# EAGLE design generic_control_board (EAGLE 5.01)
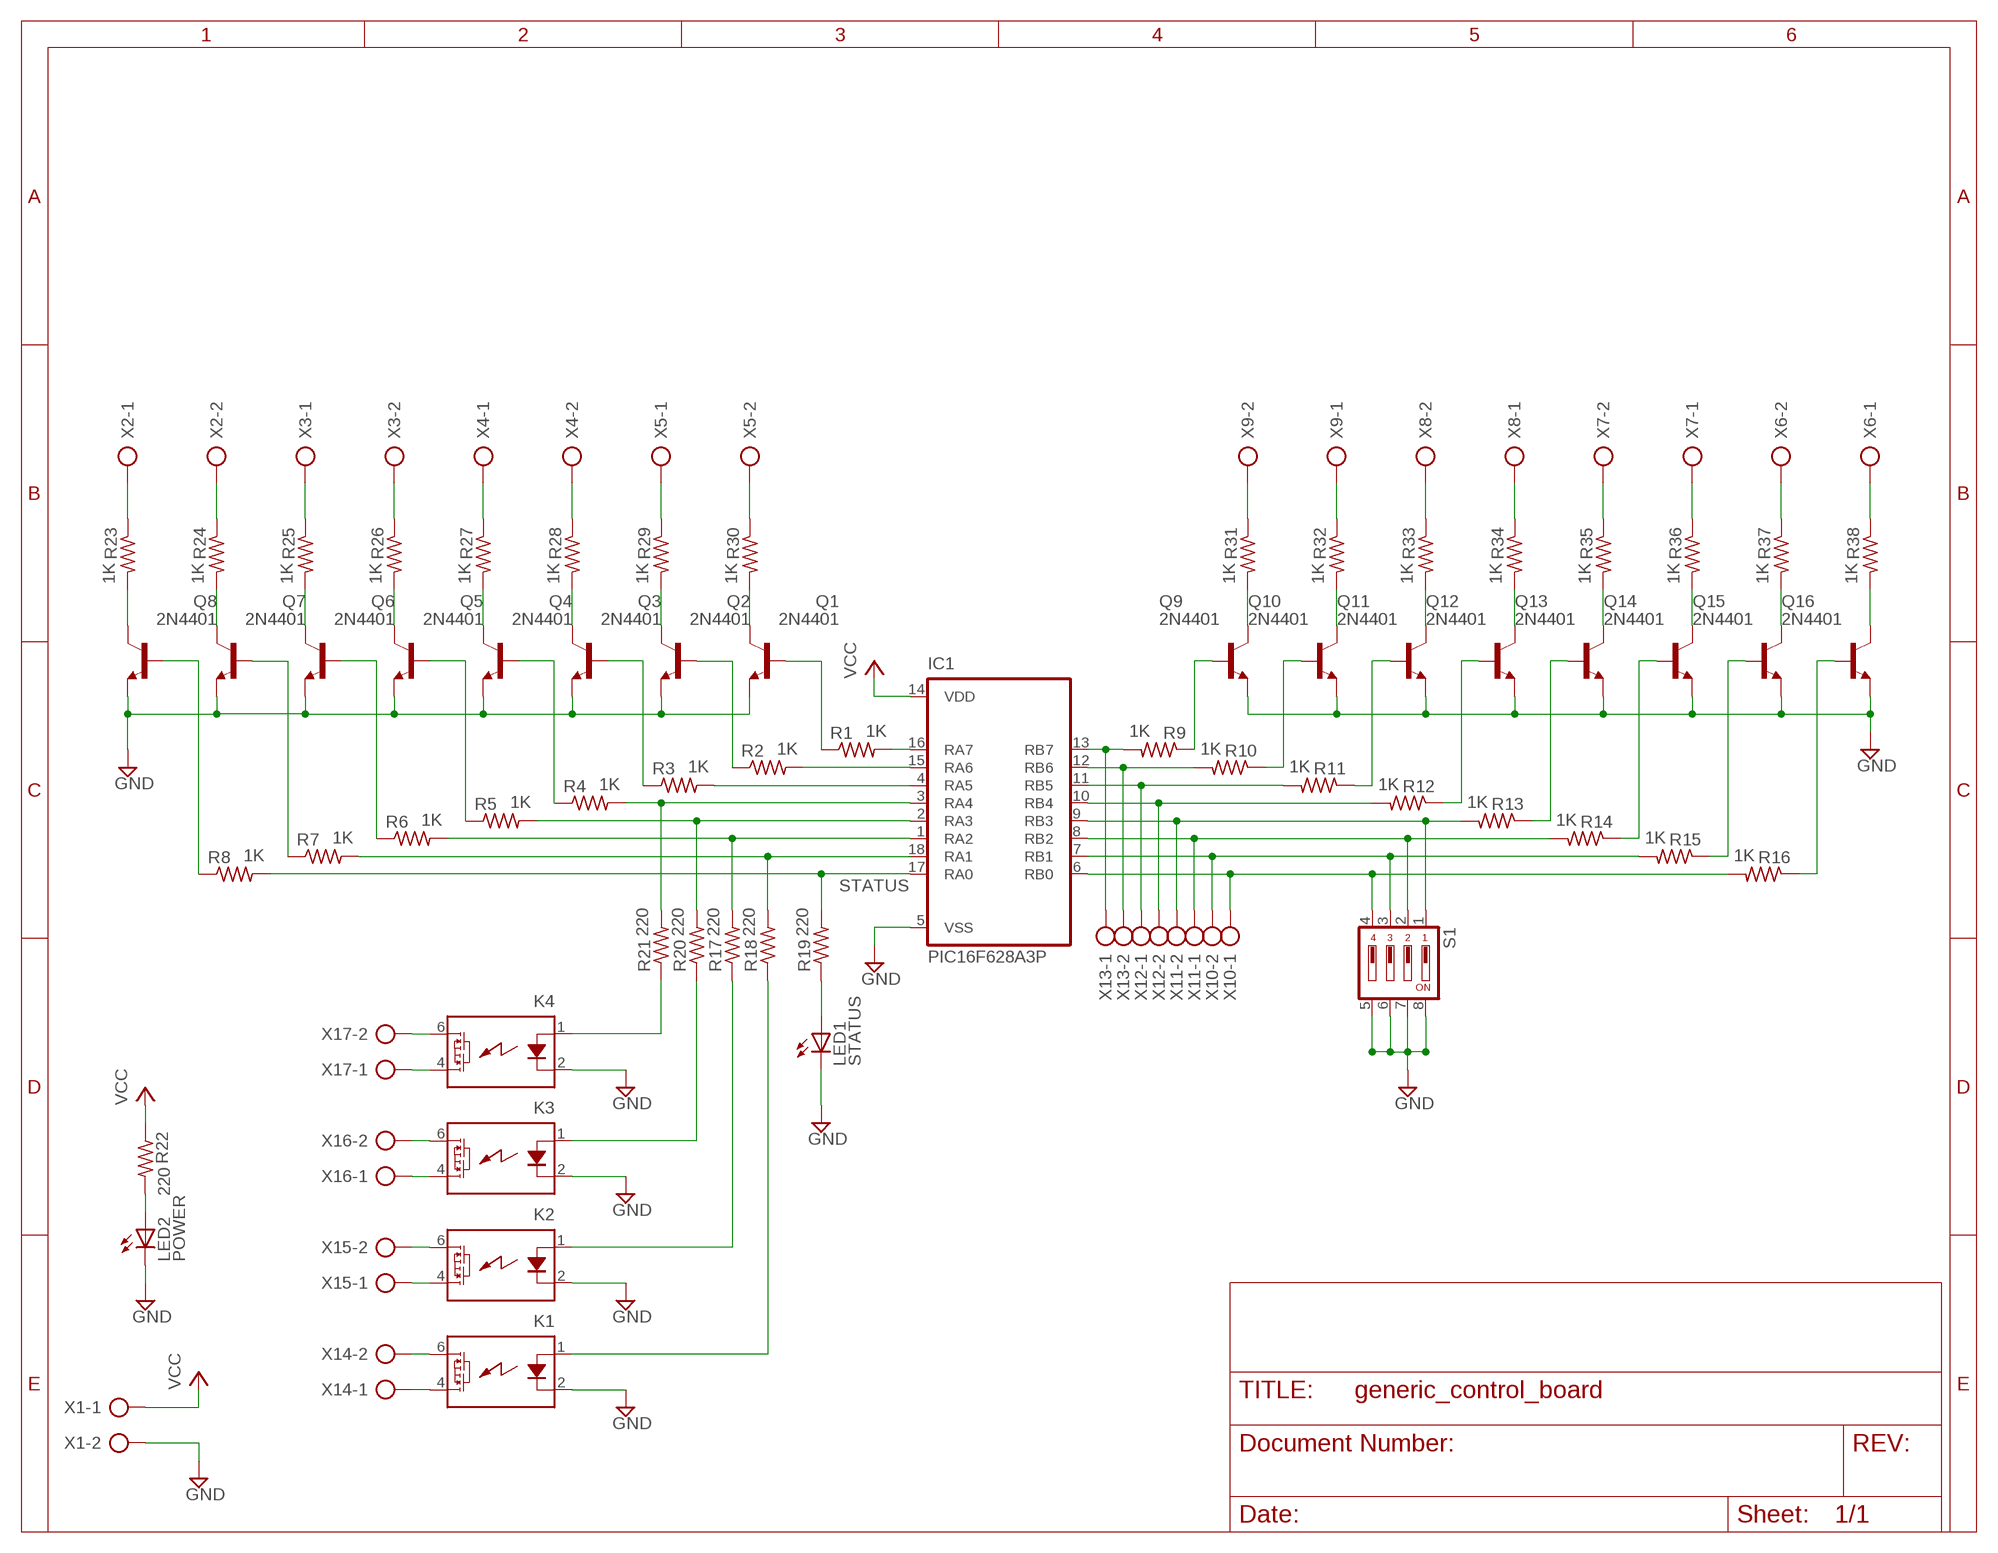
[diagram p0: schematic, sheet 1]

## Parts
IC1  PIC16F628A3P  [DIL18]
K1  LCA110  [DIL06]
K2  LCA110  [DIL06]
K3  LCA110  [DIL06]
K4  LCA110  [DIL06]
LED1  STATUS  LED3MM  [LED3MM]
LED2  POWER  LED3MM  [LED3MM]
Q1  2N4401  [TO92-CBE]
Q2  2N4401  [TO92-CBE]
Q3  2N4401  [TO92-CBE]
Q4  2N4401  [TO92-CBE]
Q5  2N4401  [TO92-CBE]
Q6  2N4401  [TO92-CBE]
Q7  2N4401  [TO92-CBE]
Q8  2N4401  [TO92-CBE]
Q9  2N4401  [TO92-CBE]
Q10  2N4401  [TO92-CBE]
Q11  2N4401  [TO92-CBE]
Q12  2N4401  [TO92-CBE]
Q13  2N4401  [TO92-CBE]
Q14  2N4401  [TO92-CBE]
Q15  2N4401  [TO92-CBE]
Q16  2N4401  [TO92-CBE]
R1  1K  R-US_0207/2V  [0207/2V]
R2  1K  R-US_0207/2V  [0207/2V]
R3  1K  R-US_0207/2V  [0207/2V]
R4  1K  R-US_0207/2V  [0207/2V]
R5  1K  R-US_0207/2V  [0207/2V]
R6  1K  R-US_0207/2V  [0207/2V]
R7  1K  R-US_0207/2V  [0207/2V]
R8  1K  R-US_0207/2V  [0207/2V]
R9  1K  R-US_0207/2V  [0207/2V]
R10  1K  R-US_0207/2V  [0207/2V]
R11  1K  R-US_0207/2V  [0207/2V]
R12  1K  R-US_0207/2V  [0207/2V]
R13  1K  R-US_0207/2V  [0207/2V]
R14  1K  R-US_0207/2V  [0207/2V]
R15  1K  R-US_0207/2V  [0207/2V]
R16  1K  R-US_0207/2V  [0207/2V]
R17  220  R-US_0207/2V  [0207/2V]
R18  220  R-US_0207/2V  [0207/2V]
R19  220  R-US_0207/2V  [0207/2V]
R20  220  R-US_0207/2V  [0207/2V]
R21  220  R-US_0207/2V  [0207/2V]
R22  220  R-US_0207/2V  [0207/2V]
R23  1K  R-US_0207/2V  [0207/2V]
R24  1K  R-US_0207/2V  [0207/2V]
R25  1K  R-US_0207/2V  [0207/2V]
R26  1K  R-US_0207/2V  [0207/2V]
R27  1K  R-US_0207/2V  [0207/2V]
R28  1K  R-US_0207/2V  [0207/2V]
R29  1K  R-US_0207/2V  [0207/2V]
R30  1K  R-US_0207/2V  [0207/2V]
R31  1K  R-US_0207/2V  [0207/2V]
R32  1K  R-US_0207/2V  [0207/2V]
R33  1K  R-US_0207/2V  [0207/2V]
R34  1K  R-US_0207/2V  [0207/2V]
R35  1K  R-US_0207/2V  [0207/2V]
R36  1K  R-US_0207/2V  [0207/2V]
R37  1K  R-US_0207/2V  [0207/2V]
R38  1K  R-US_0207/2V  [0207/2V]
S1  DIP04YL  [DIP04YL]
X1  AK500/2  [AK500/2]
X2  AK500/2  [AK500/2]
X3  AK500/2  [AK500/2]
X4  AK500/2  [AK500/2]
X5  AK500/2  [AK500/2]
X6  AK500/2  [AK500/2]
X7  AK500/2  [AK500/2]
X8  AK500/2  [AK500/2]
X9  AK500/2  [AK500/2]
X10  AK500/2  [AK500/2]
X11  AK500/2  [AK500/2]
X12  AK500/2  [AK500/2]
X13  AK500/2  [AK500/2]
X14  AK500/2  [AK500/2]
X15  AK500/2  [AK500/2]
X16  AK500/2  [AK500/2]
X17  AK500/2  [AK500/2]

## Nets
AC1-A: K1.6(D1) X14.2
AC1-B: K1.4(D2) X14.1
AC2-A: K2.6(D1) X15.2
AC2-B: K2.4(D2) X15.1
AC3-A: K3.6(D1) X16.2
AC3-B: K3.4(D2) X16.1
AC4-A: K4.6(D1) X17.2
AC4-B: K4.4(D2) X17.1
GND: IC1.5(VSS) K1.2(K) K2.2(K) K3.2(K) K4.2(K) LED1.K(C) LED2.K(C) Q1.E Q2.E Q3.E Q4.E Q5.E Q6.E Q7.E Q8.E Q9.E Q10.E Q11.E Q12.E Q13.E Q14.E Q15.E Q16.E S1.5 S1.6 S1.7 S1.8 X1.2
IN1: IC1.6(RB0) R16.2 S1.4 X10.1
IN2: IC1.7(RB1) R15.2 S1.3 X10.2
IN3: IC1.8(RB2) R14.2 S1.2 X11.1
IN4: IC1.9(RB3) R13.2 S1.1 X11.2
IN5: IC1.10(RB4) R12.2 X12.2
IN6: IC1.11(RB5) R11.2 X12.1
IN7: IC1.12(RB6) R10.2 X13.2
IN8: IC1.13(RB7) R9.2 X13.1
N$1: Q16.C R38.2
N$2: Q15.C R37.2
N$3: Q11.B R11.1
N$4: Q8.B R8.1
N$5: Q1.B R1.1
N$6: Q14.C R36.2
N$7: Q2.B R2.1
N$8: Q3.B R3.1
N$9: Q4.B R4.1
N$10: Q5.B R5.1
N$11: Q12.B R12.1
N$12: Q13.B R13.1
N$13: Q14.B R14.1
N$14: Q6.B R6.1
N$15: Q13.C R35.2
N$16: Q12.C R34.2
N$17: Q11.C R33.2
N$18: Q10.C R32.2
N$20: Q1.C R30.2
N$22: Q7.B R7.1
N$23: Q15.B R15.1
N$25: Q2.C R29.2
N$31: Q16.B R16.1
N$32: LED1.A R19.1
N$34: Q3.C R28.2
N$35: Q4.C R27.2
N$36: Q5.C R26.2
N$37: Q6.C R25.2
N$38: Q7.C R24.2
N$39: Q8.C R23.2
N$40: R23.1 X2.1
N$41: R24.1 X2.2
N$42: R25.1 X3.1
N$43: R26.1 X3.2
N$44: R27.1 X4.1
N$45: R28.1 X4.2
N$46: R29.1 X5.1
N$47: R30.1 X5.2
N$48: K2.1(A) R17.1
N$49: K1.1(A) R18.1
N$50: R31.1 X9.2
N$51: Q10.B R10.1
N$52: R32.1 X9.1
N$53: R33.1 X8.2
N$54: R34.1 X8.1
N$55: K4.1(A) R21.1
N$56: K3.1(A) R20.1
N$57: R35.1 X7.2
N$58: R36.1 X7.1
N$59: R37.1 X6.2
N$60: R38.1 X6.1
N$61: LED2.A R22.2
OUT2: IC1.18(RA1) R7.2 R18.2
OUT3: IC1.1(RA2) R6.2 R17.2
OUT4: IC1.2(RA3) R5.2 R20.2
OUT5: IC1.3(RA4) R4.2 R21.2
OUT6: IC1.4(RA5) R3.2
OUT7: IC1.15(RA6) R2.2
OUT8: IC1.16(RA7) R1.2
Q9B: Q9.B R9.1
Q9C: Q9.C R31.2
STATUS: IC1.17(RA0) R8.2 R19.2
VCC: IC1.14(VDD) R22.1 X1.1

## Library data of the parts
IC1 = microchip:PIC16F628A: MICROCONTROLLER 8-Bit PIC16F628 Family - CMOS Flash/EEPROM Pin Compatible : PIC16F83, PIC16CR83, PIC16F84A, PIC16CR84 see also PIC16C*
K1-K4 = relay:LCA110: Solid state relay. Clare LCA110
LED1 LED2 = led:LED: LED OSRAM: - CHIPLED LG R971, LG N971, LY N971, LG Q971, LY Q971, LO R971, LY R971 LH N974, LH R974 LS Q976, LO Q976, LY Q976 LO Q996 - Hyper CHIPLED LW Q18S LB Q993, LB Q99A, LB R99A - SideLED LS A670, LO A670, LY A670, LG A670, LP A670 LB A673, LV A673, LT A673, LW A673 LH A674 LY A675 LS A676, LA A676, LO A676, LY A676, LW A676 LS A679, LY A679, LG A679 - Hyper Micro SIDELED® LS Y876, LA Y876, LO Y876, LY Y876 LT Y87S - SmartLED LW L88C, LW L88S LB L89C, LB L89S, LG L890 LS L89K, LO L89K, LY L89K LS L896, LA L896, LO L896, LY L896 - TOPLED LS T670, LO T670, LY T670, LG T670, LP T670 LSG T670, LSP T670, LSY T670, LOP T670, LYG T670 LG T671, LOG T671, LSG T671 LB T673, LV T673, LT T673, LW T673 LH T674 LS T676, LA T676, LO T676, LY T676, LB T676, LH T676, LSB T676, LW T676 LB T67C, LV T67C, LT T67C, LS T67K, LO T67K, LY T67K, LW E67C LS E67B, LA E67B, LO E67B, LY E67B, LB E67C, LV E67C, LT E67C LW T67C LS T679, LY T679, LG T679 LS T770, LO T770, LY T770, LG T770, LP T770 LB T773, LV T773, LT T773, LW T773 LH T774 LS E675, LA E675, LY E675, LS T675 LS T776, LA T776, LO T776, LY T776, LB T776 LHGB T686 LT T68C, LB T68C - Hyper Mini TOPLED® LB M676 - Mini TOPLED Santana® LG M470 LS M47K, LO M47K, LY M47K Source: http://www.osram.convergy.de - LUMILED® LXK2-PW12-R00, LXK2-PW12-S00, LXK2-PW14-U00, LXK2-PW14-V00 LXK2-PM12-R00, LXK2-PM12-S00, LXK2-PM14-U00 LXK2-PE12-Q00, LXK2-PE12-R00, LXK2-PE12-S00, LXK2-PE14-T00, LXK2-PE14-U00 LXK2-PB12-K00, LXK2-PB12-L00, LXK2-PB12-M00, LXK2-PB14-N00, LXK2-PB14-P00, LXK2-PB14-Q00 LXK2-PR12-L00, LXK2-PR12-M00, LXK2-PR14-Q00, LXK2-PR14-R00 LXK2-PD12-Q00, LXK2-PD12-R00, LXK2-PD12-S00 LXK2-PH12-R00, LXK2-PH12-S00 LXK2-PL12-P00, LXK2-PL12-Q00, LXK2-PL12-R00 Source: www.luxeon.com
Q1-Q16 = transistor-npn:2N4401: Small signal transistor
R1-R38 = rcl:R-US_: RESISTOR, American symbol
S1 = switch-dil:DIP04YL: DIL/CODE SWITCH
X1-X17 = con-ptr500:AK500/2: CONNECTOR

## Board
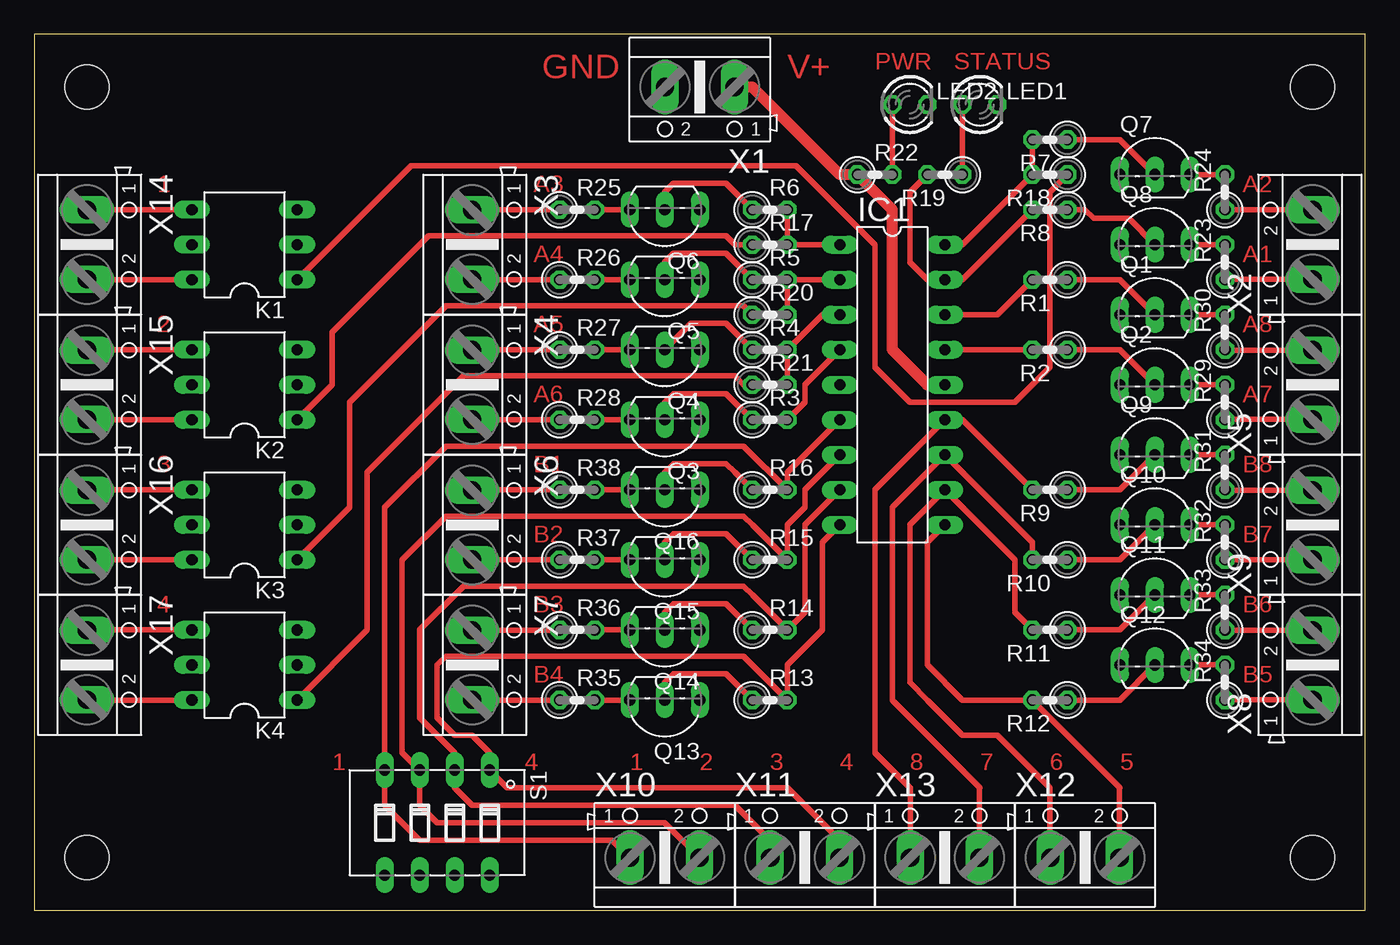
[diagram p1: board, top side]
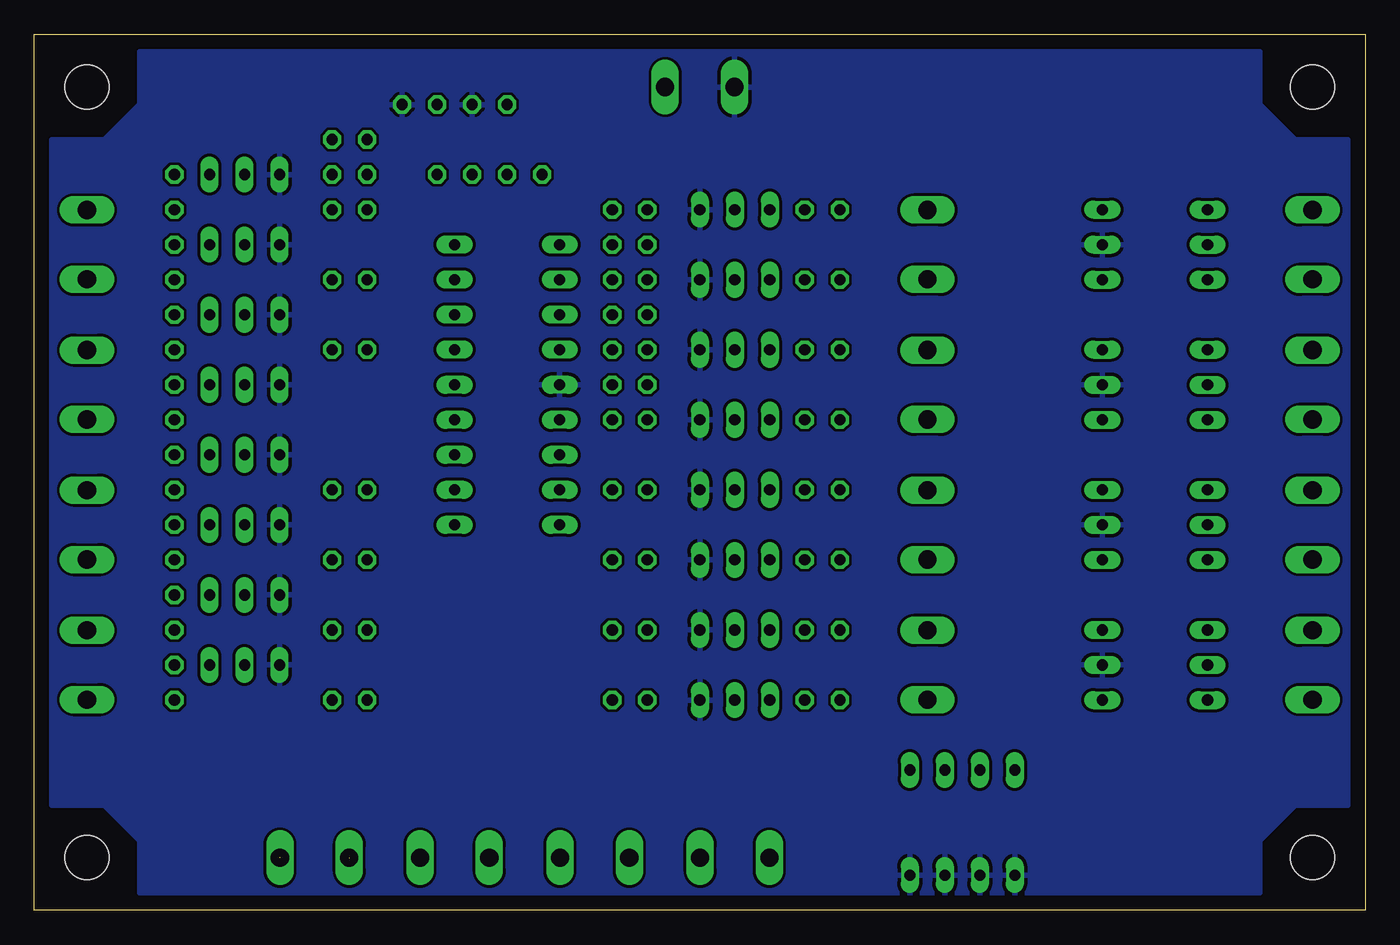
[diagram p2: board, bottom side, seen from below]

Size 96.52 x 63.5 mm. Coordinates in mm from the lower left corner, seen from the top.
Outline: 0,0 96.52,0 96.52,63.5 0,63.5 0,0
Copper layers (1*16): Top 0.035mm / dielectric 1.5mm / Bottom 0.035mm
Design rules "default *": minimum track width 10mil, minimum drill 24mil, track to track 8mil, track to pad 12mil, pad to pad 8mil, via to via 8mil, smd to smd 8mil, copper to edge 40mil, drill to drill 8mil, minimum pad ring 10mil, minimum via ring 8mil, stop-mask expansion 4mil, vias tented up to drill 0mil, thermal gap 10mil
Holes 3.2 mm at 92.71,59.69 92.71,3.81 3.81,3.81 3.81,59.69

### Footprints (pad centres in the part's own frame; a part is rotated, then mirrored left to right if it is on the bottom)
DIL18@1 = drill 0.813 long: 1 -10.16,-3.81; 2 -7.62,-3.81; 3 -5.08,-3.81; 4 -2.54,-3.81; 5 0,-3.81; 6 2.54,-3.81; 7 5.08,-3.81; 8 7.62,-3.81; 9 10.16,-3.81; 10 10.16,3.81; 11 7.62,3.81; 12 5.08,3.81; 13 2.54,3.81; 14 0,3.81; 15 -2.54,3.81; 16 -5.08,3.81; 17 -7.62,3.81; 18 -10.16,3.81
DIL06 = drill 0.813 long: 1 -2.54,-3.81; 2 0,-3.81; 3 2.54,-3.81; 4 2.54,3.81; 5 0,3.81; 6 -2.54,3.81
LED3MM = drill 0.813 octagon: A -1.27,0; K 1.27,0
TO92-CBE = drill 0.813 long: B 0,0; C 2.54,0; E -2.54,0
0207/2V = drill 0.813 octagon: 1 -1.27,0; 2 1.27,0
DIP04YL = drill 0.813 long: 1 -3.81,-3.81; 2 -1.27,-3.81; 3 1.27,-3.81; 4 3.81,-3.81; 5 3.81,3.81; 6 1.27,3.81; 7 -1.27,3.81; 8 -3.81,3.81
AK500/2 = drill 1.321 long: 1 -2.515,0; 2 2.515,0

### Placement (x,y rotation side)
IC1  PIC16F628A3P  [DIL18@1]  62.23,38.1 270 top
K1  15.24,48.26 90 top
K2  15.24,38.1 90 top
K3  15.24,27.94 90 top
K4  15.24,17.78 90 top
LED1  68.58,58.42 0 top
LED2  63.5,58.42 0 top
Q1  81.28,43.18 0 top
Q2  81.28,38.1 0 top
Q3  45.72,35.56 180 top
Q4  45.72,40.64 180 top
Q5  45.72,45.72 180 top
Q6  45.72,50.8 180 top
Q7  81.28,53.34 0 top
Q8  81.28,48.26 0 top
Q9  81.28,33.02 0 top
Q10  81.28,27.94 0 top
Q11  81.28,22.86 0 top
Q12  81.28,17.78 0 top
Q13  45.72,15.24 180 top
Q14  45.72,20.32 180 top
Q15  45.72,25.4 180 top
Q16  45.72,30.48 180 top
R1  73.66,45.72 180 top
R2  73.66,40.64 180 top
R3  53.34,35.56 0 top
R4  53.34,40.64 0 top
R5  53.34,45.72 0 top
R6  53.34,50.8 0 top
R7  73.66,55.88 180 top
R8  73.66,50.8 180 top
R9  73.66,30.48 180 top
R10  73.66,25.4 180 top
R11  73.66,20.32 180 top
R12  73.66,15.24 180 top
R13  53.34,15.24 0 top
R14  53.34,20.32 0 top
R15  53.34,25.4 0 top
R16  53.34,30.48 0 top
R17  53.34,48.26 0 top
R18  73.66,53.34 180 top
R19  66.04,53.34 180 top
R20  53.34,43.18 0 top
R21  53.34,38.1 0 top
R22  60.96,53.34 0 top
R23  86.36,46.99 90 top
R24  86.36,52.07 90 top
R25  39.37,50.8 0 top
R26  39.37,45.72 0 top
R27  39.37,40.64 0 top
R28  39.37,35.56 0 top
R29  86.36,36.83 90 top
R30  86.36,41.91 90 top
R31  86.36,31.75 90 top
R32  86.36,26.67 90 top
R33  86.36,21.59 90 top
R34  86.36,16.51 90 top
R35  39.37,15.24 0 top
R36  39.37,20.32 0 top
R37  39.37,25.4 0 top
R38  39.37,30.48 0 top
S1  29.21,6.35 180 top
X1  48.26,59.69 180 top
X2  92.71,48.26 90 top
X3  31.75,48.26 270 top
X4  31.75,38.1 270 top
X5  92.71,38.1 90 top
X6  31.75,27.94 270 top
X7  31.75,17.78 270 top
X8  92.71,17.78 90 top
X9  92.71,27.94 90 top
X10  45.72,3.81 0 top
X11  55.88,3.81 0 top
X12  76.2,3.81 0 top
X13  66.04,3.81 0 top
X14  3.81,48.26 270 top
X15  3.81,38.1 270 top
X16  3.81,27.94 270 top
X17  3.81,17.78 270 top

### Tracks (layer width: path | path; a pad name or v marks a point on that pad's centre or on a via)
AC1-A
  Top 0.406: X14.2 3.81,45.72 K1.6
AC1-B
  Top 0.406: X14.1 3.81,50.8 K1.4
AC2-A
  Top 0.406: X15.2 3.81,35.56 K2.6
AC2-B
  Top 0.406: X15.1 3.81,40.64 K2.4
AC3-A
  Top 0.406: X16.2 3.81,25.4 K3.6
AC3-B
  Top 0.406: X16.1 3.81,30.48 K3.4
AC4-A
  Top 0.406: X17.2 3.81,15.24 K4.6
AC4-B
  Top 0.406: X17.1 3.81,20.32 K4.4
GND
  pour Bottom: 1.27,55.88 5.08,55.88 7.62,58.42 7.62,62.23 88.9,62.23 88.9,58.42 91.44,55.88 95.25,55.88 95.25,7.62 91.44,7.62 88.9,5.08 88.9,1.27 7.62,1.27 7.62,5.08 5.08,7.62 1.27,7.62
IN1
  Top 0.406: IC1.6 57.15,34.29 54.61,31.75 R16.2 51.44,33.66 29.84,33.66 25.4,29.21 25.4,11.43 S1.4 25.4,7.62 27.94,5.08 41.91,5.08 43.18,3.81 X10.1
IN2
  Top 0.406: X10.2 48.26,3.81 45.72,6.35 29.21,6.35 27.94,7.62 S1.3 26.67,11.43 26.67,25.4 29.84,28.57 51.44,28.57 52.07,27.94 R15.2 54.61,27.94 55.88,29.21 55.88,30.48 IC1.7
IN3
  Top 0.406: X11.1 53.37,5.05 50.8,7.62 31.75,7.62 30.48,8.89 S1.2 30.48,11.43 29.21,12.7 27.94,13.97 27.94,20.32 31.11,23.5 51.44,23.5 52.07,22.86 R14.2 55.88,21.59 55.88,24.13 55.88,27.94 IC1.8
IN4
  Top 0.406: X11.2 58.4,5.11 54.61,8.89 34.29,8.89 S1.1 33.02,11.43 31.75,12.7 30.48,12.7 29.21,13.97 29.21,17.78 29.84,18.41 51.44,18.41 R13.2 54.61,17.78 55.88,19.05 57.15,20.32 57.15,24.13 57.15,26.67 IC1.9
IN5  (1 unrouted)
  Top 0.406: IC1.10 64.77,26.67 64.77,17.78 67.31,15.24 R12.2 78.74,8.89 78.72,8.87 78.72,3.83
IN6  (1 unrouted)
  Top 0.406: 73.66,3.81 73.66,8.89 69.85,12.7 67.31,12.7 64.77,15.24 63.5,16.51 63.5,27.94 IC1.11 71.12,25.4 71.12,21.59 R11.2
IN7
  Top 0.406: X13.2 68.56,8.87 68.58,8.89 64.77,12.7 62.23,15.24 62.23,29.21 IC1.12 72.39,26.67 R10.2
IN8
  Top 0.406: X13.1 63.52,8.87 63.5,8.89 60.96,11.43 60.96,30.48 IC1.13 67.31,35.56 71.12,31.75 R9.2
N$1
  Top 0.406: R38.2 Q16.C
N$2
  Top 0.406: R37.2 Q15.C
N$3
  Top 0.406: Q11.B 78.74,20.32 77.47,20.32 R11.1
N$4
  Top 0.406: Q8.B 79.38,50.16 76.83,50.16 76.2,50.8 R8.1
N$5
  Top 0.406: Q1.B 78.74,45.72 77.47,45.72 R1.1
N$6
  Top 0.406: R36.2 Q14.C
N$7
  Top 0.406: Q2.B 78.74,40.64 77.47,40.64 R2.1
N$8
  Top 0.406: R3.1 50.16,37.47 46.35,37.47 45.72,36.83 Q3.B
N$9
  Top 0.406: R4.1 50.16,42.55 47.62,42.55 Q4.B
N$10
  Top 0.406: R5.1 50.16,47.62 46.35,47.62 45.72,46.99 Q5.B
N$11
  Top 0.406: Q12.B 78.74,15.24 77.47,15.24 R12.1
N$12
  Top 0.406: R13.1 50.16,17.14 46.35,17.14 45.72,16.51 Q13.B
N$13
  Top 0.406: R14.1 50.16,22.23 46.35,22.23 45.72,21.59 Q14.B
N$14
  Top 0.406: R6.1 50.16,52.7 46.35,52.7 45.72,52.07 Q6.B
N$15
  Top 0.406: R35.2 Q13.C
N$16
  Top 0.406: Q12.C R34.2
N$17
  Top 0.406: Q11.C R33.2
N$18
  Top 0.406: Q10.C R32.2
N$20
  Top 0.406: Q1.C R30.2
N$22
  Top 0.406: Q7.B 78.74,55.88 77.47,55.88 R7.1
N$23
  Top 0.406: R15.1 50.16,27.3 46.35,27.3 45.72,26.67 Q15.B
N$25
  Top 0.406: Q2.C R29.2
N$31
  Top 0.406: R16.1 50.8,31.75 50.16,32.38 46.35,32.38 45.72,31.75 Q16.B
N$32
  Top 0.406: R19.1 LED1.A
N$34
  Top 0.406: R28.2 Q3.C
N$35
  Top 0.406: R27.2 Q4.C
N$36
  Top 0.406: R26.2 Q5.C
N$37
  Top 0.406: R25.2 Q6.C
N$38
  Top 0.406: Q7.C R24.2
N$39
  Top 0.406: Q8.C R23.2
N$40
  Top 0.406: X2.1 86.39,45.74 R23.1
N$41
  Top 0.406: X2.2 86.39,50.77 R24.1
N$42
  Top 0.406: X3.1 31.75,50.8 R25.1
N$43
  Top 0.406: X3.2 31.75,45.72 R26.1
N$44
  Top 0.406: X4.1 31.75,40.64 R27.1
N$45
  Top 0.406: R28.1 33.02,35.56 31.75,35.56 X4.2
N$46
  Top 0.406: X5.1 86.39,35.59 R29.1
N$47
  Top 0.406: X5.2 86.39,40.62 R30.1
N$48
  Top 0.406: R17.1 50.8,48.26 50.16,48.9 28.57,48.9 21.59,41.91 21.59,38.1 K2.1
N$49
  Top 0.406: K1.1 27.3,53.98 53.98,53.98 55.24,53.98 60.96,48.26 60.96,39.37 63.5,36.83 71.12,36.83 73.66,39.37 73.66,52.07 R18.1
N$50
  Top 0.406: X9.2 86.39,30.45 R31.1
N$51
  Top 0.406: Q10.B 78.74,25.4 77.47,25.4 R10.1
N$52
  Top 0.406: R32.1 86.39,25.43 92.69,25.43 92.71,25.4 X9.1
N$53
  Top 0.406: X8.2 86.39,20.3 R33.1
N$54
  Top 0.406: X8.1 86.39,15.27 R34.1
N$55
  Top 0.406: R21.1 51.44,38.1 50.8,38.73 31.11,38.73 30.48,38.1 24.13,31.75 24.13,20.32 K4.1
N$56
  Top 0.406: R20.1 51.44,43.81 29.84,43.81 22.86,36.83 22.86,29.21 K3.1
N$57
  Top 0.406: X7.2 31.75,15.24 R35.1
N$58
  Top 0.406: X7.1 38.08,20.3 R36.1
N$59
  Top 0.406: X6.2 38.08,25.43 R37.1
N$60
  Top 0.406: X6.1 31.75,30.48 R38.1
N$61
  Top 0.406: R22.2 LED2.A
OUT2
  Top 0.406: IC1.18 67.31,48.26 68.58,49.53 R18.2 R7.2
OUT3
  Top 0.406: IC1.1 R17.2 R6.2
OUT4
  Top 0.406: IC1.2 R5.2 R20.2
OUT5
  Top 0.406: R21.2 R4.2 57.15,43.18 IC1.3
OUT6
  Top 0.406: R3.2 55.88,36.83 55.88,38.1 IC1.4
OUT7
  Top 0.406: IC1.15 R2.2
OUT8
  Top 0.406: IC1.16 69.85,43.18 R1.2
Q9B
  Top 0.406: Q9.B 78.74,30.48 77.47,30.48 R9.1
Q9C
  Top 0.406: Q9.C R31.2
STATUS
  Top 0.406: R8.2 67.31,45.72 IC1.17 64.77,45.72 63.5,46.99 63.5,50.8 63.5,52.07 R19.2
VCC
  Top 0.813: IC1.14 64.77,38.1 62.23,40.64 62.23,49.53 62.23,50.8 R22.1 58.42,53.34 52.07,59.69 50.8,59.69 X1.1

### Text on the board
Top: PWR | STATUS | GND | V+ | 1 | A3 | A2 | A4 | A1 | 2 | A5 | A8 | A6 | A7 | 3 | B1 | B8 | B2 | B7 | 4 | B3 | B6 | B4 | B5 | 1 | 4 | 1 | 2 | 3 | 4 | 8 | 7 | 6 | 5